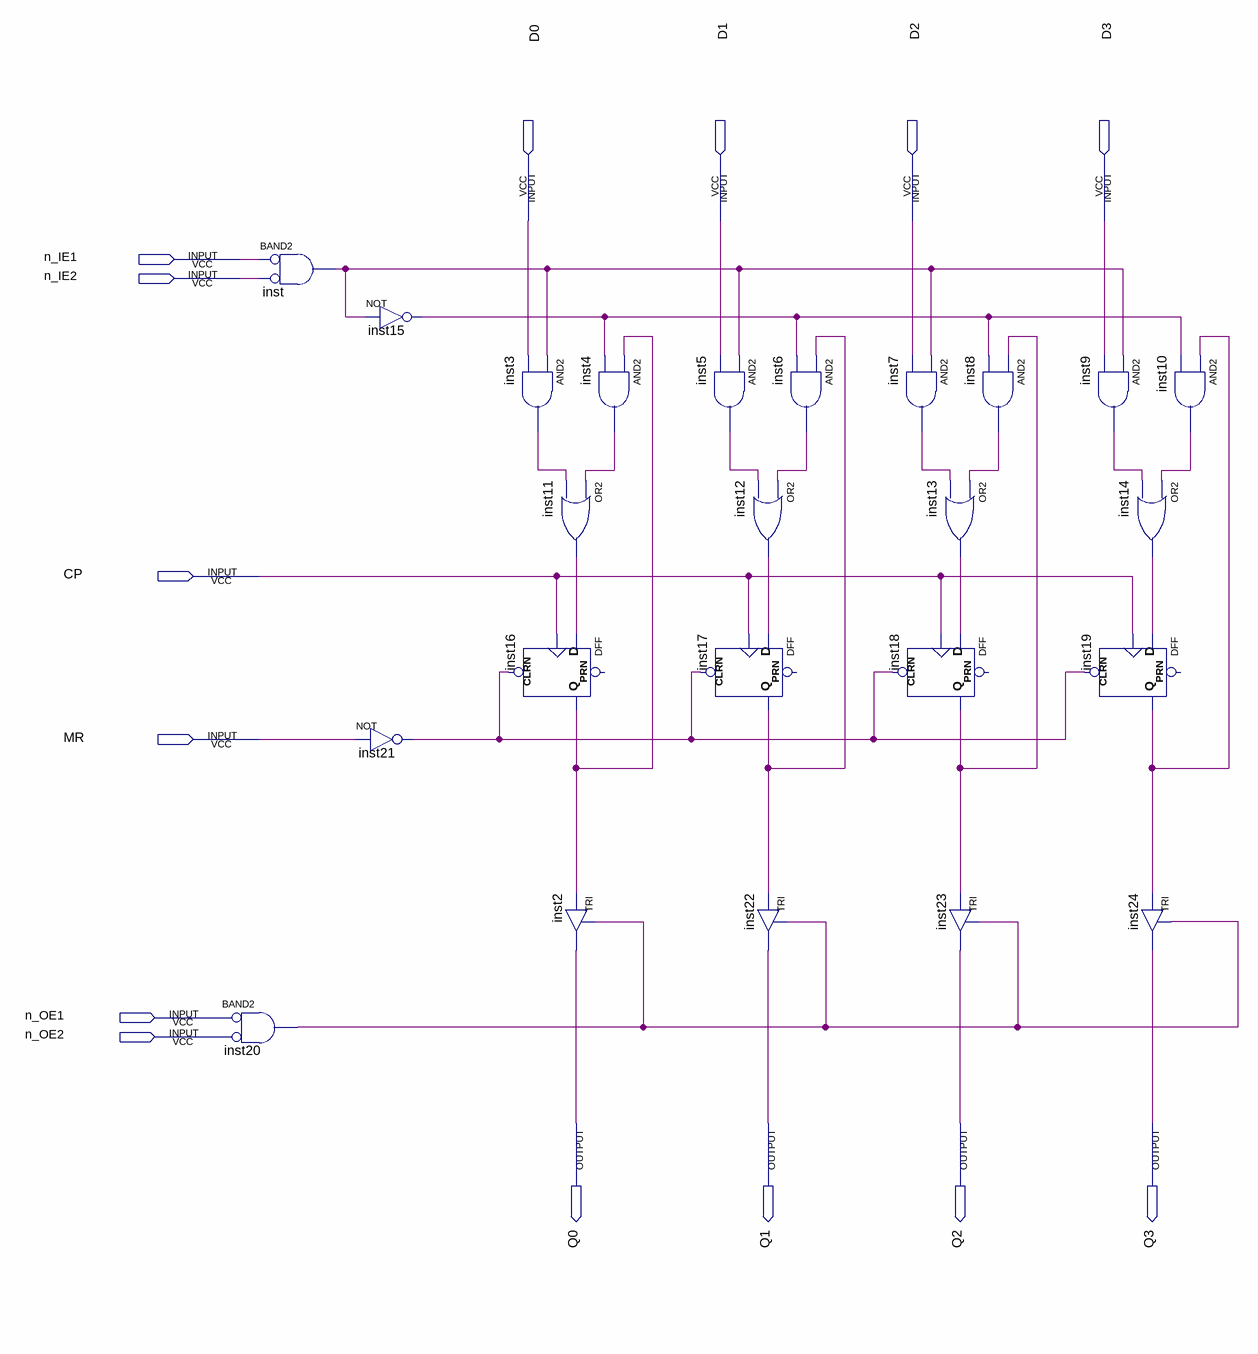
[diagram p0: schematic sheet]
// Quartus schematic ci74173.bdf as structural Verilog: 24 symbols, 14 pins
module ci74173 (
  input  D0,
  input  D1,
  input  D2,
  input  D3,
  input  n_IE1,
  input  n_IE2,
  input  CP,
  input  MR,
  input  n_OE1,
  input  n_OE2,
  output Q0,
  output Q1,
  output Q2,
  output Q3
);

  wire inst3_out, inst4_out, inst5_out, inst6_out, inst7_out, inst8_out, inst9_out, inst10_out, inst11_out,
       inst12_out, inst13_out, inst14_out, inst15_out, inst16_q, inst17_q, inst18_q, inst19_q, inst20_out,
       inst21_out, inst_out;

  and inst (inst_out, ~n_IE1, ~n_IE2);  // BAND2
  and inst20 (inst20_out, ~n_OE1, ~n_OE2);  // BAND2
  not inst15 (inst15_out, inst_out);
  not inst21 (inst21_out, MR);
  and inst3 (inst3_out, inst_out, D0);
  DFF inst16 (.CLRN(inst21_out), .CLK(CP), .D(inst11_out), .Q(inst16_q));  // open: PRN
  and inst4 (inst4_out, inst16_q, inst15_out);
  or inst11 (inst11_out, inst4_out, inst3_out);
  TRI inst2 (.IN(inst16_q), .OE(inst20_out), .OUT(Q0));
  and inst5 (inst5_out, inst_out, D1);
  or inst12 (inst12_out, inst6_out, inst5_out);
  DFF inst17 (.CLRN(inst21_out), .CLK(CP), .D(inst12_out), .Q(inst17_q));  // open: PRN
  TRI inst22 (.IN(inst17_q), .OE(inst20_out), .OUT(Q1));
  and inst6 (inst6_out, inst17_q, inst15_out);
  and inst7 (inst7_out, inst_out, D2);
  DFF inst18 (.CLRN(inst21_out), .CLK(CP), .D(inst13_out), .Q(inst18_q));  // open: PRN
  and inst8 (inst8_out, inst18_q, inst15_out);
  or inst13 (inst13_out, inst8_out, inst7_out);
  TRI inst23 (.IN(inst18_q), .OE(inst20_out), .OUT(Q2));
  and inst9 (inst9_out, inst_out, D3);
  or inst14 (inst14_out, inst10_out, inst9_out);
  DFF inst19 (.CLRN(inst21_out), .CLK(CP), .D(inst14_out), .Q(inst19_q));  // open: PRN
  TRI inst24 (.IN(inst19_q), .OE(inst20_out), .OUT(Q3));
  and inst10 (inst10_out, inst19_q, inst15_out);
endmodule
